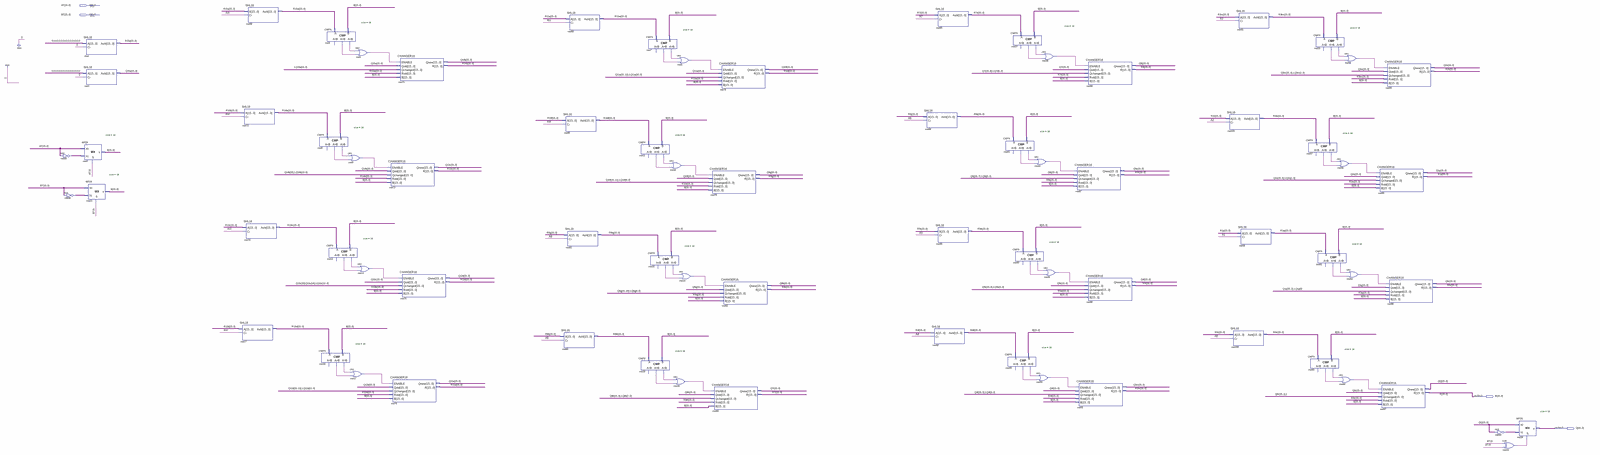
[diagram p0: schematic sheet, whole]
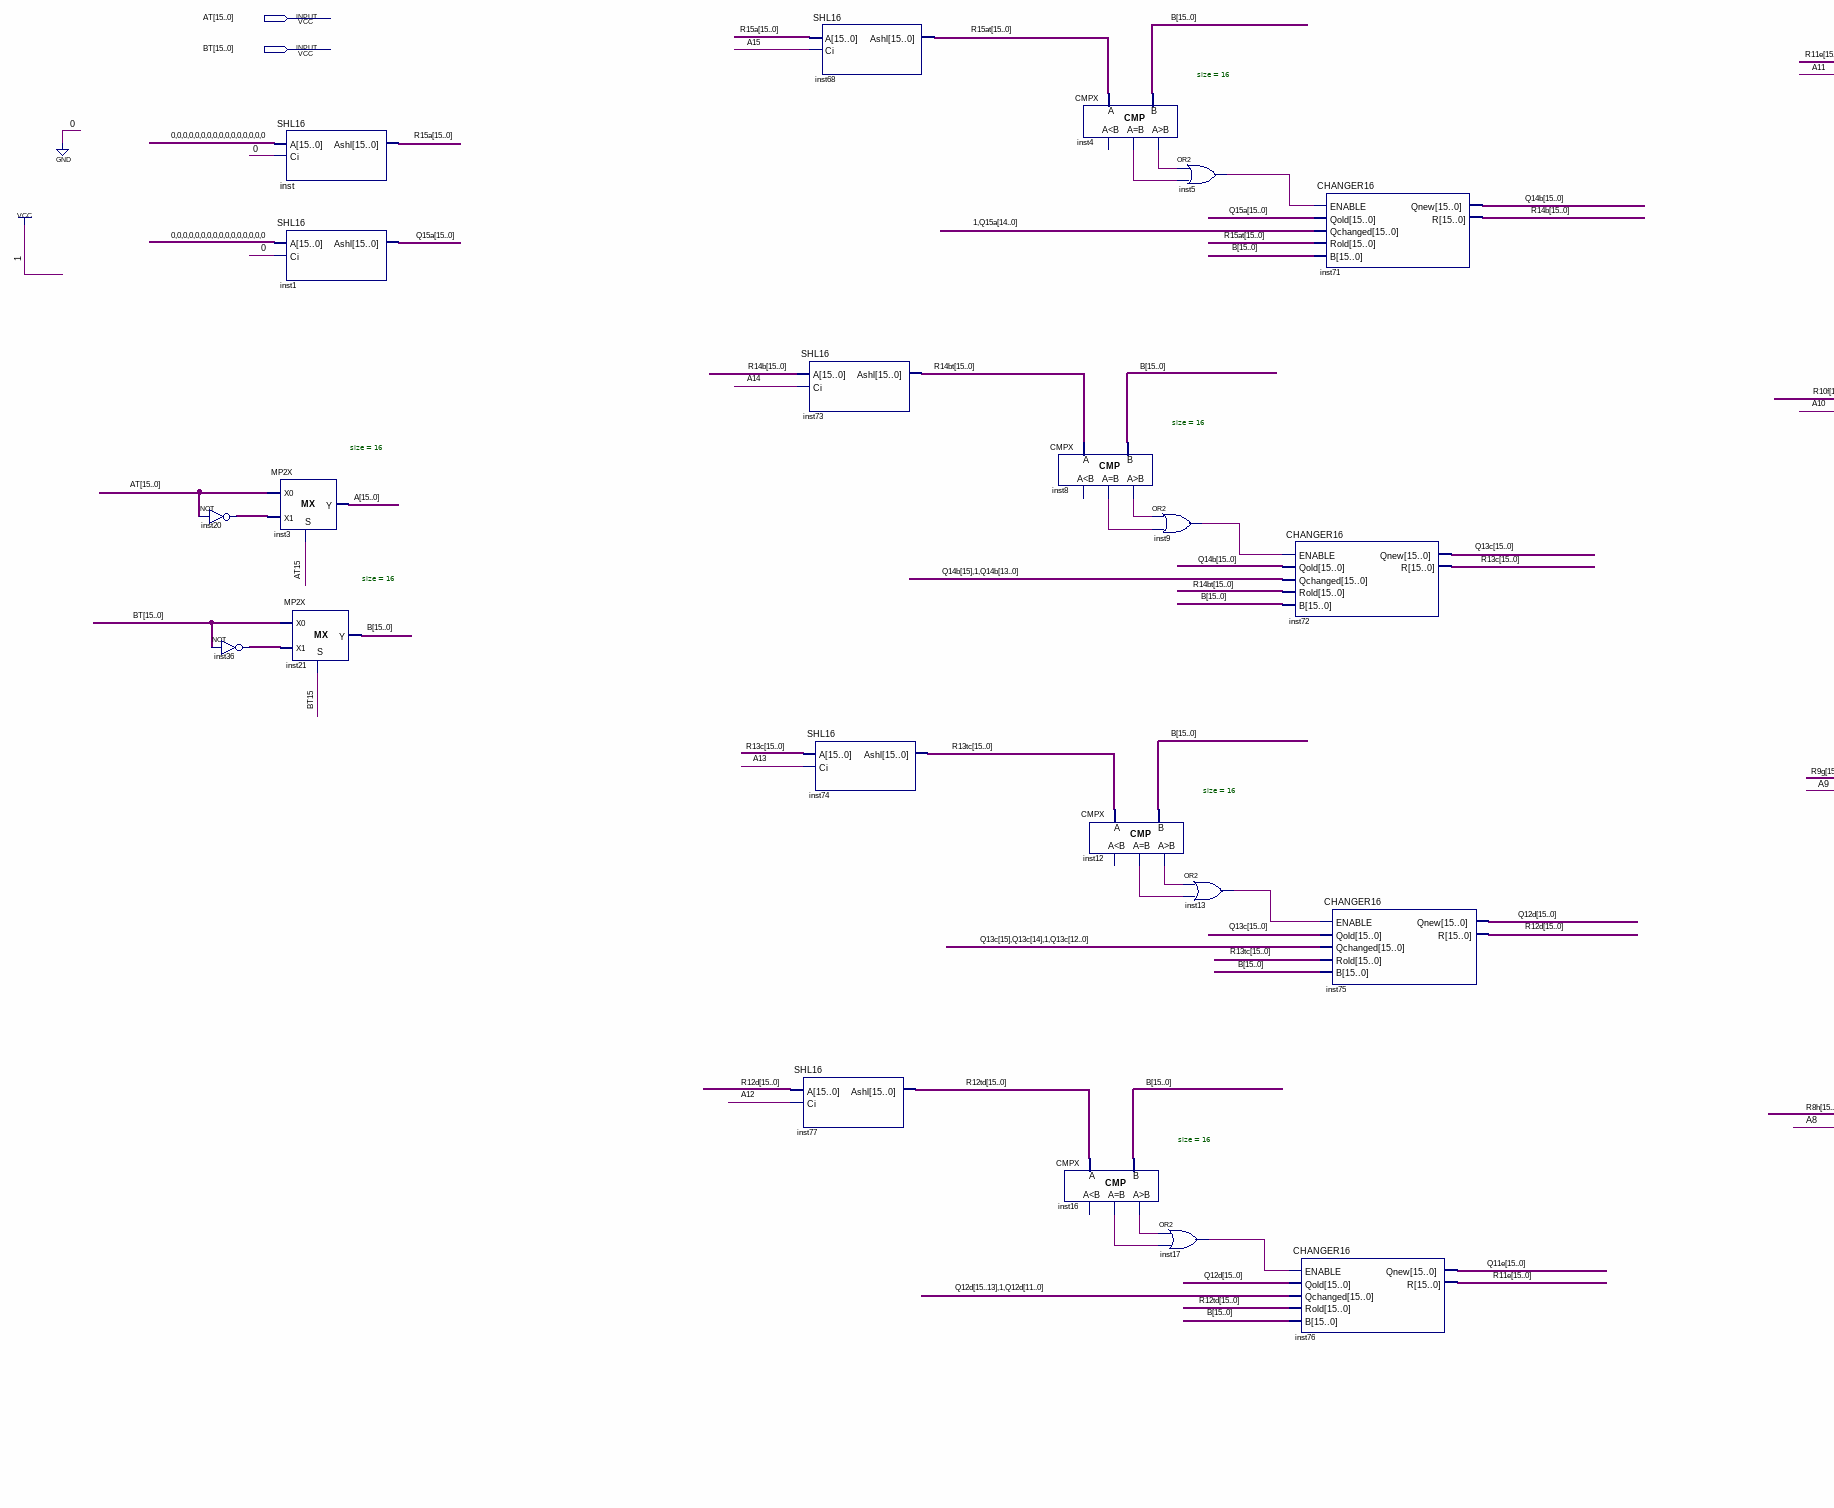
[diagram p1: schematic sheet, left part]
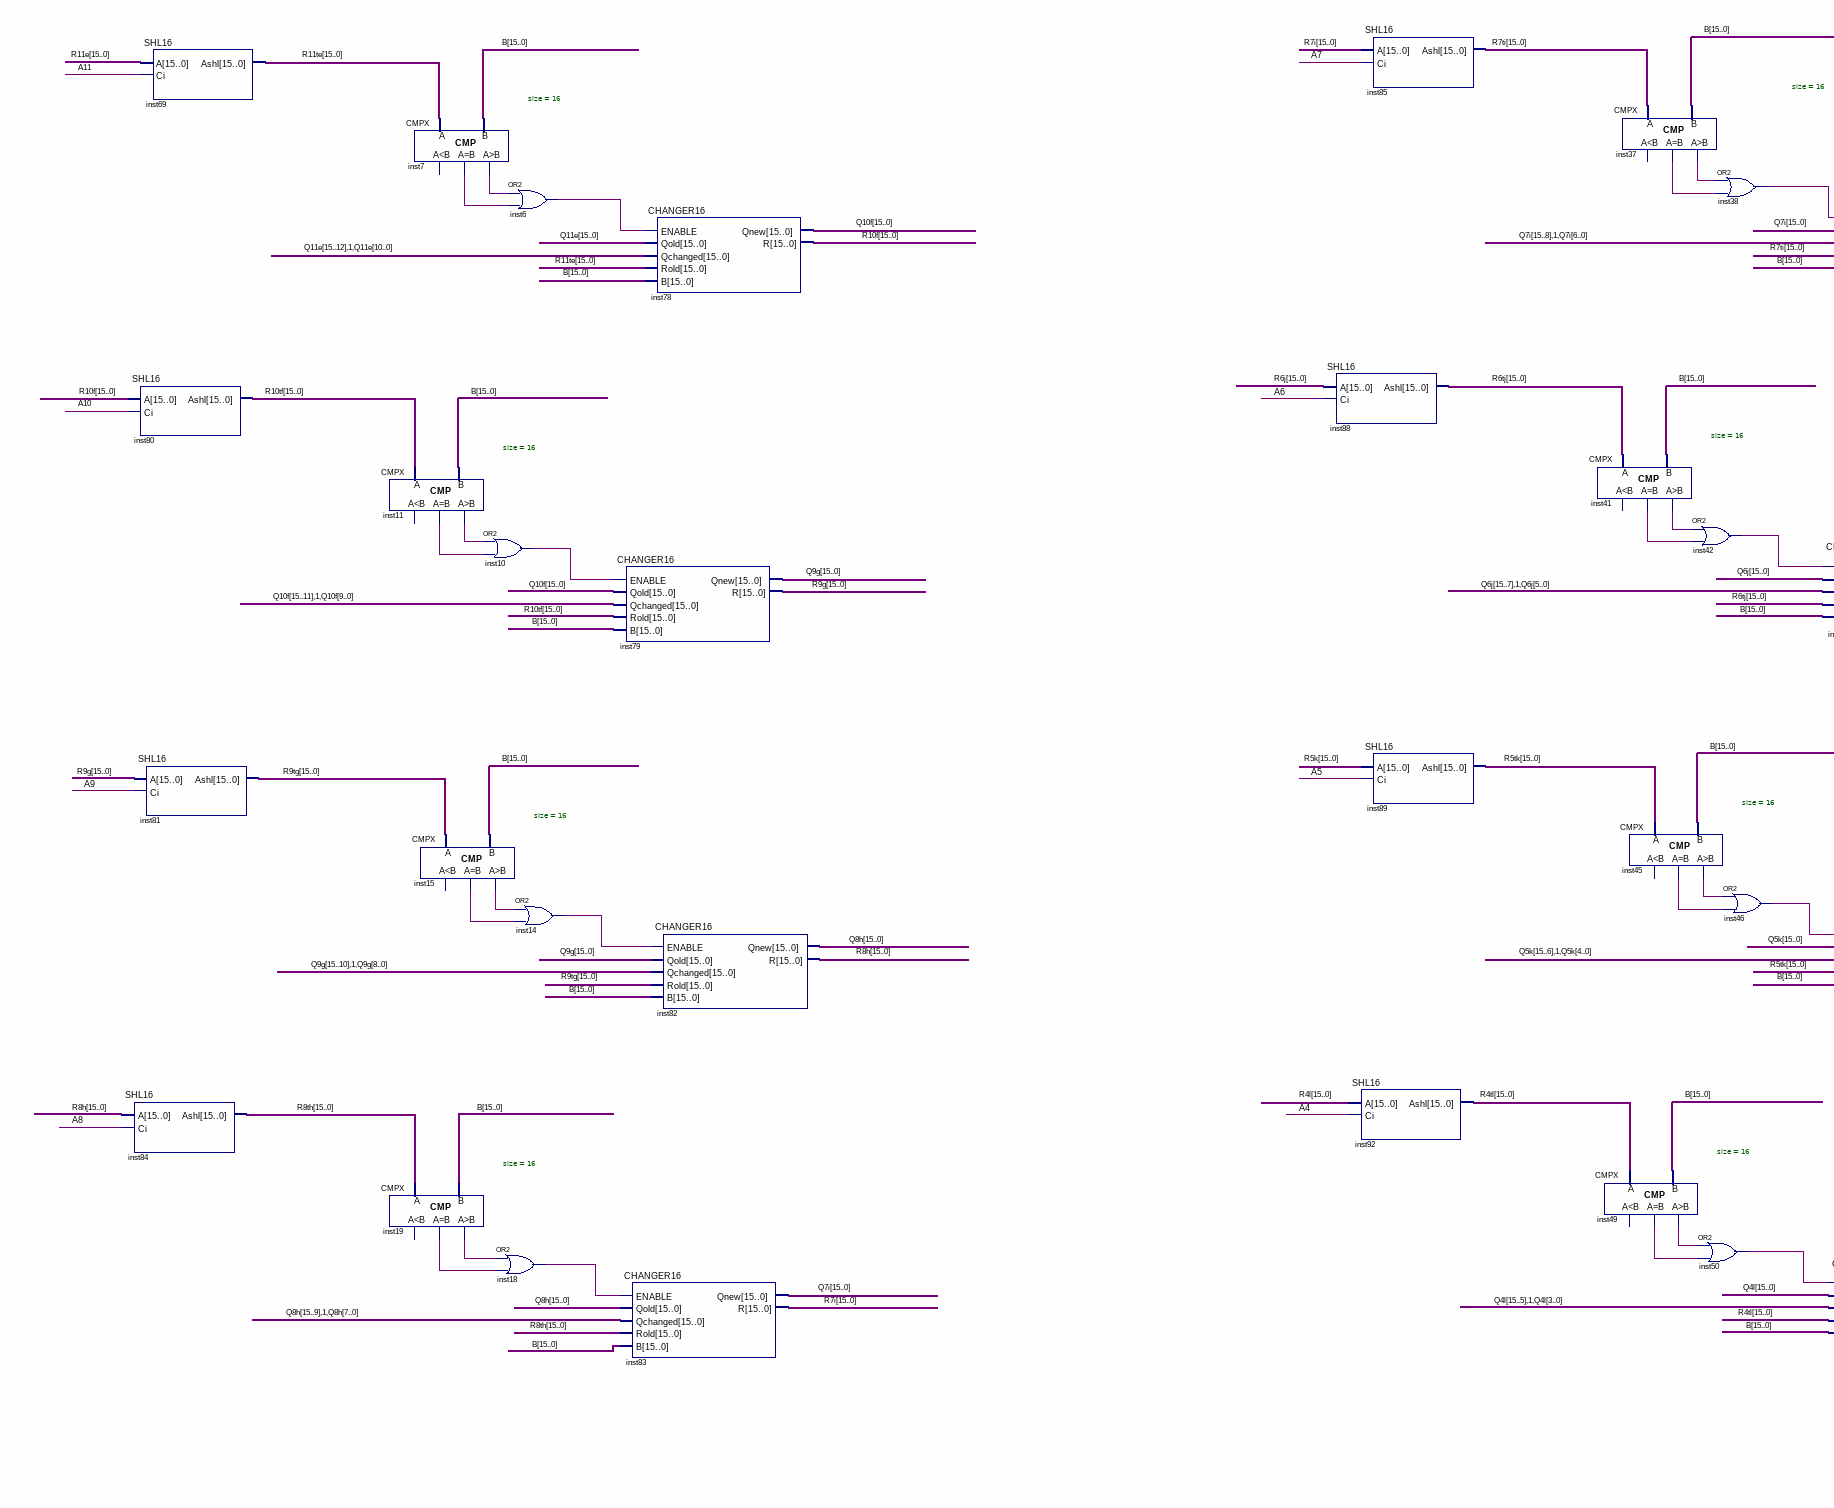
[diagram p2: schematic sheet, centre part]
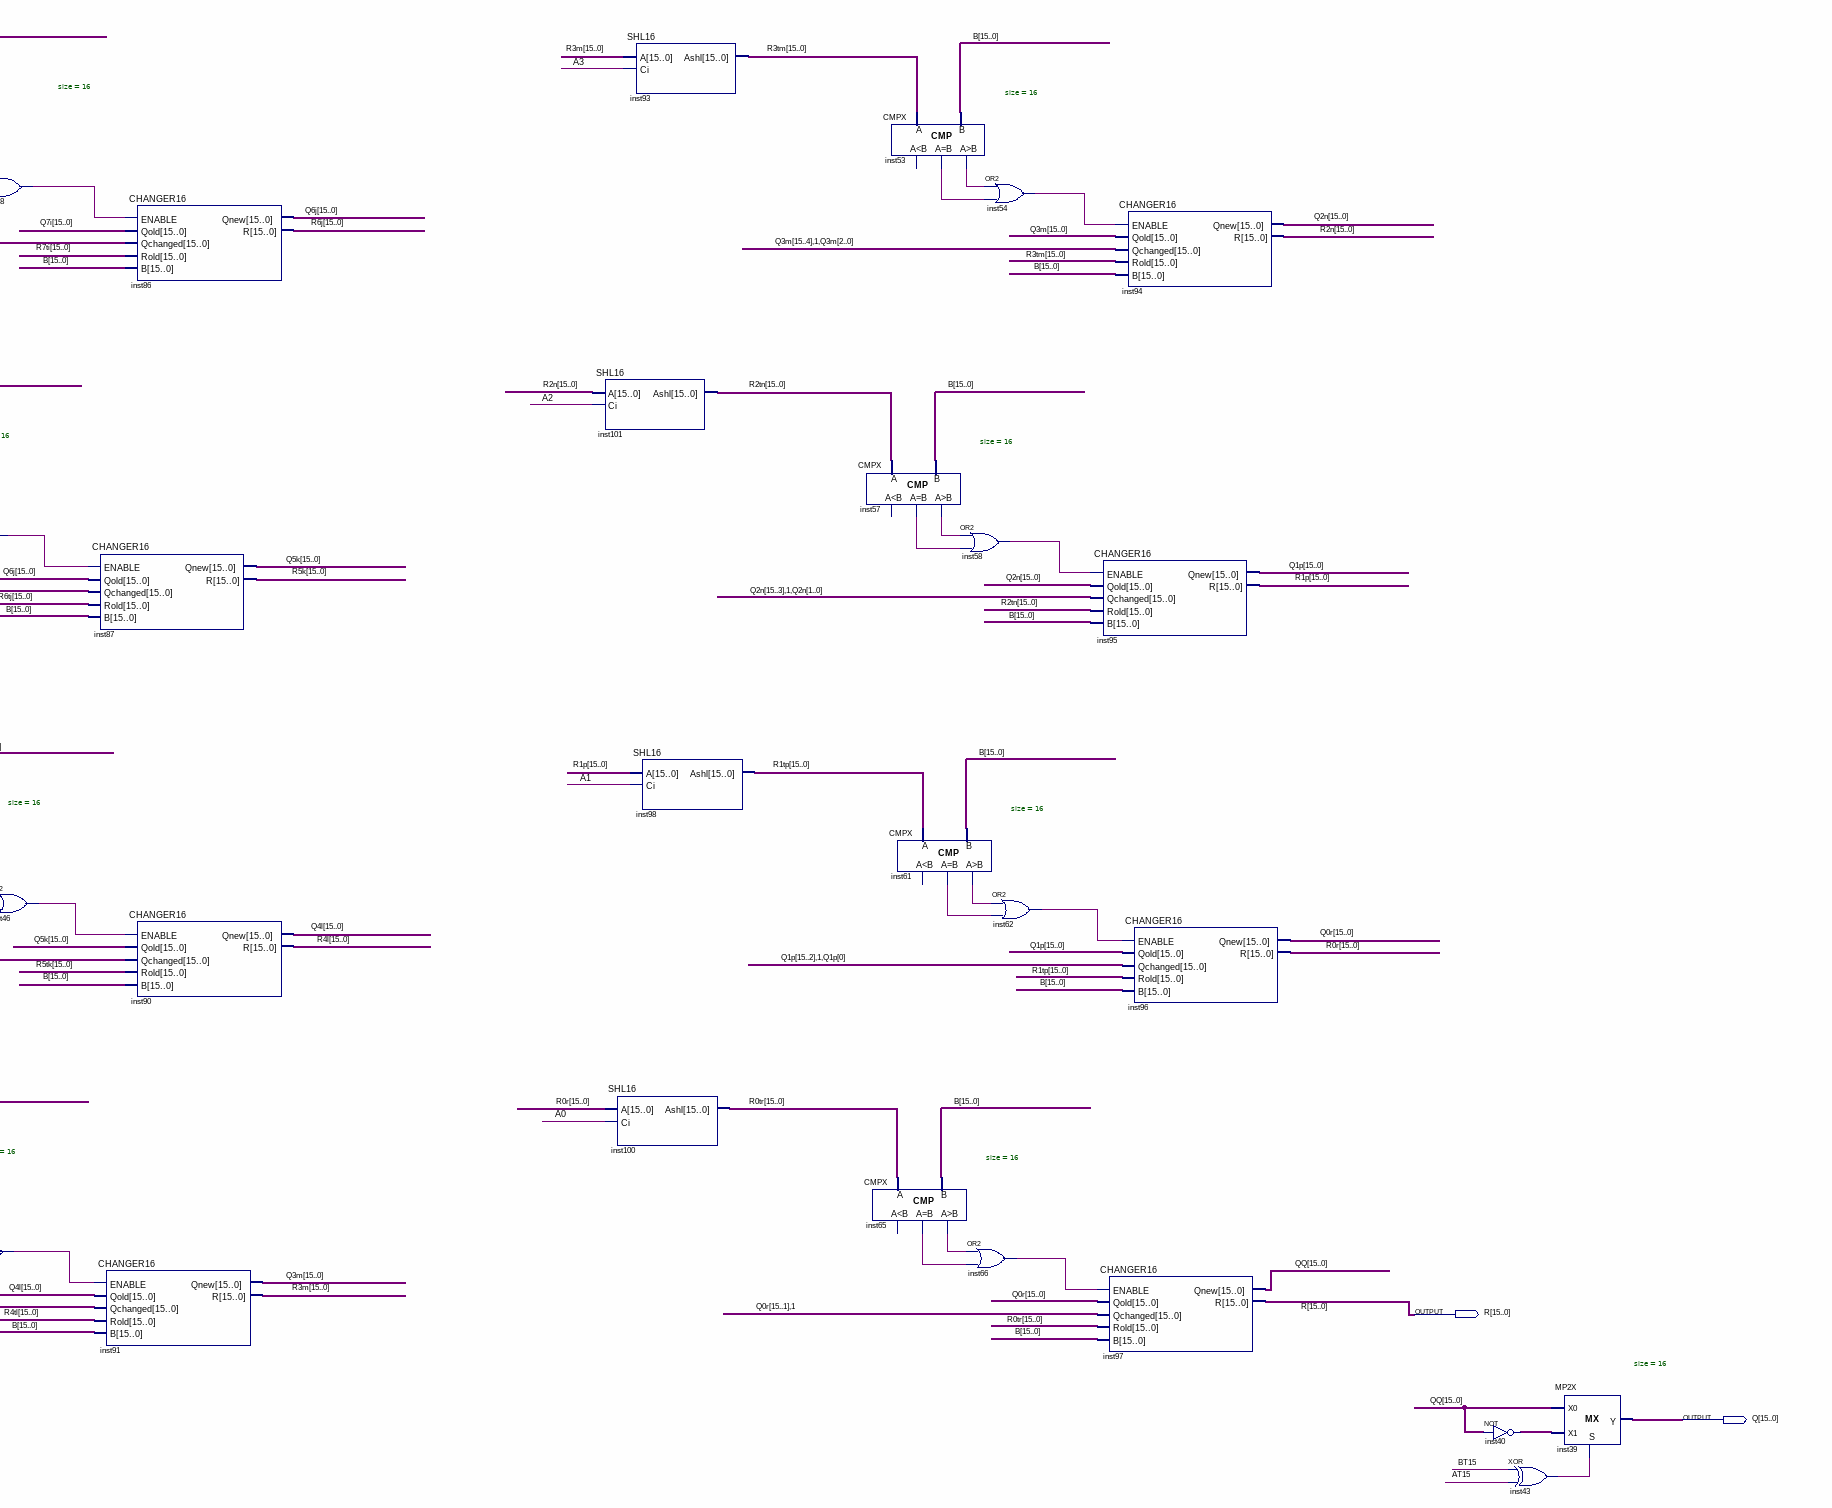
[diagram p3: schematic sheet, right part]
// Quartus schematic DIV16.bdf as structural Verilog: 73 symbols, 4 pins
module DIV16 (
  input  [15:0] AT,
  input  [15:0] BT,
  output [15:0] R,
  output [15:0] Q
);

  wire inst4_eq, inst4_gr, inst5_out, inst6_out, inst7_eq, inst7_gr, inst8_eq, inst8_gr, inst9_out,
       inst10_out, inst11_eq, inst11_gr, inst12_eq, inst12_gr, inst13_out, inst14_out, inst15_eq, inst15_gr,
       inst16_eq, inst16_gr, inst17_out, inst18_out, inst19_eq, inst19_gr, inst37_eq, inst37_gr, inst38_out,
       inst41_eq, inst41_gr, inst42_out, inst43_out, inst45_eq, inst45_gr, inst46_out, inst49_eq, inst49_gr,
       inst50_out, inst53_eq, inst53_gr, inst54_out, inst57_eq, inst57_gr, inst58_out, inst61_eq, inst61_gr,
       inst62_out, inst65_eq, inst65_gr, inst66_out;
  wire [15:0] A, B, inst20_out, inst36_out, inst40_out, Q0r, Q1p, Q2n, Q3m, Q4l, Q5k, Q6j, Q7i, Q8h, Q9g,
       Q10f, Q11e, Q12d, Q13c, Q14b, Q15a, QQ, R0r, R0tr, R1p, R1tp, R2n, R2tn, R3m, R3tm, R4l, R4tl, R5k,
       R5tk, R6j, R6tj, R7i, R7ti, R8h, R8th, R9g, R9tg, R10f, R10tf, R11e, R11te, R12d, R12td, R13c, R13tc,
       R14b, R14bt, R15a, R15at;

  assign inst20_out = ~AT;  // NOT inst20, 16 bits wide
  assign inst36_out = ~BT;  // NOT inst36, 16 bits wide
  SHL16 inst (.A({16{1'b0}}), .Ci(1'b0), .Ashl(R15a));
  SHL16 inst1 (.A({16{1'b0}}), .Ci(1'b0), .Ashl(Q15a));
  MP2X #(.size(16)) inst3 (.S(AT[15]), .X0(AT), .X1(inst20_out), .Y(A));
  MP2X #(.size(16)) inst21 (.S(BT[15]), .X0(BT), .X1(inst36_out), .Y(B));
  SHL16 inst68 (.A(R15a), .Ci(A[15]), .Ashl(R15at));
  SHL16 inst73 (.A(R14b), .Ci(A[14]), .Ashl(R14bt));
  SHL16 inst74 (.A(R13c), .Ci(A[13]), .Ashl(R13tc));
  SHL16 inst77 (.A(R12d), .Ci(A[12]), .Ashl(R12td));
  CMPX #(.size(16)) inst4 (.A(R15at), .B(B), .eq(inst4_eq), .gr(inst4_gr));  // open: ls
  CMPX #(.size(16)) inst8 (.A(R14bt), .B(B), .eq(inst8_eq), .gr(inst8_gr));  // open: ls
  CMPX #(.size(16)) inst12 (.A(R13tc), .B(B), .eq(inst12_eq), .gr(inst12_gr));  // open: ls
  CMPX #(.size(16)) inst16 (.A(R12td), .B(B), .eq(inst16_eq), .gr(inst16_gr));  // open: ls
  or inst5 (inst5_out, inst4_gr, inst4_eq);
  or inst9 (inst9_out, inst8_gr, inst8_eq);
  or inst17 (inst17_out, inst16_gr, inst16_eq);
  or inst13 (inst13_out, inst12_gr, inst12_eq);
  CHANGER16 inst71 (
    .ENABLE(inst5_out), .Qold(Q15a), .Qchanged({1'b1, Q15a[14:0]}), .Rold(R15at), .B(B), .Qnew(Q14b), .R(R14b));
  CHANGER16 inst72 (
    .ENABLE(inst9_out), .Qold(Q14b), .Qchanged({Q14b[15], 1'b1, Q14b[13:0]}), .Rold(R14bt), .B(B),
    .Qnew(Q13c), .R(R13c));
  CHANGER16 inst75 (
    .ENABLE(inst13_out), .Qold(Q13c), .Qchanged({Q13c[15:14], 1'b1, Q13c[12:0]}), .Rold(R13tc), .B(B),
    .Qnew(Q12d), .R(R12d));
  CHANGER16 inst76 (
    .ENABLE(inst17_out), .Qold(Q12d), .Qchanged({Q12d[15:13], 1'b1, Q12d[11:0]}), .Rold(R12td), .B(B),
    .Qnew(Q11e), .R(R11e));
  SHL16 inst69 (.A(R11e), .Ci(A[11]), .Ashl(R11te));
  SHL16 inst80 (.A(R10f), .Ci(A[10]), .Ashl(R10tf));
  SHL16 inst81 (.A(R9g), .Ci(A[9]), .Ashl(R9tg));
  SHL16 inst84 (.A(R8h), .Ci(A[8]), .Ashl(R8th));
  CMPX #(.size(16)) inst11 (.A(R10tf), .B(B), .eq(inst11_eq), .gr(inst11_gr));  // open: ls
  CMPX #(.size(16)) inst19 (.A(R8th), .B(B), .eq(inst19_eq), .gr(inst19_gr));  // open: ls
  CMPX #(.size(16)) inst7 (.A(R11te), .B(B), .eq(inst7_eq), .gr(inst7_gr));  // open: ls
  CMPX #(.size(16)) inst15 (.A(R9tg), .B(B), .eq(inst15_eq), .gr(inst15_gr));  // open: ls
  or inst10 (inst10_out, inst11_gr, inst11_eq);
  or inst6 (inst6_out, inst7_gr, inst7_eq);
  or inst14 (inst14_out, inst15_gr, inst15_eq);
  or inst18 (inst18_out, inst19_gr, inst19_eq);
  CHANGER16 inst79 (
    .ENABLE(inst10_out), .Qold(Q10f), .Qchanged({Q10f[15:11], 1'b1, Q10f[9:0]}), .Rold(R10tf), .B(B),
    .Qnew(Q9g), .R(R9g));
  CHANGER16 inst83 (
    .ENABLE(inst18_out), .Qold(Q8h), .Qchanged({Q8h[15:9], 1'b1, Q8h[7:0]}), .Rold(R8th), .B(B), .Qnew(Q7i),
    .R(R7i));
  CHANGER16 inst78 (
    .ENABLE(inst6_out), .Qold(Q11e), .Qchanged({Q11e[15:12], 1'b1, Q11e[10:0]}), .Rold(R11te), .B(B),
    .Qnew(Q10f), .R(R10f));
  CHANGER16 inst82 (
    .ENABLE(inst14_out), .Qold(Q9g), .Qchanged({Q9g[15:10], 1'b1, Q9g[8:0]}), .Rold(R9tg), .B(B), .Qnew(Q8h),
    .R(R8h));
  SHL16 inst88 (.A(R6j), .Ci(A[6]), .Ashl(R6tj));
  SHL16 inst85 (.A(R7i), .Ci(A[7]), .Ashl(R7ti));
  SHL16 inst89 (.A(R5k), .Ci(A[5]), .Ashl(R5tk));
  SHL16 inst92 (.A(R4l), .Ci(A[4]), .Ashl(R4tl));
  CMPX #(.size(16)) inst41 (.A(R6tj), .B(B), .eq(inst41_eq), .gr(inst41_gr));  // open: ls
  CMPX #(.size(16)) inst37 (.A(R7ti), .B(B), .eq(inst37_eq), .gr(inst37_gr));  // open: ls
  CMPX #(.size(16)) inst45 (.A(R5tk), .B(B), .eq(inst45_eq), .gr(inst45_gr));  // open: ls
  CMPX #(.size(16)) inst49 (.A(R4tl), .B(B), .eq(inst49_eq), .gr(inst49_gr));  // open: ls
  or inst38 (inst38_out, inst37_gr, inst37_eq);
  or inst42 (inst42_out, inst41_gr, inst41_eq);
  or inst46 (inst46_out, inst45_gr, inst45_eq);
  or inst50 (inst50_out, inst49_gr, inst49_eq);
  CHANGER16 inst87 (
    .ENABLE(inst42_out), .Qold(Q6j), .Qchanged({Q6j[15:7], 1'b1, Q6j[5:0]}), .Rold(R6tj), .B(B), .Qnew(Q5k),
    .R(R5k));
  CHANGER16 inst91 (
    .ENABLE(inst50_out), .Qold(Q4l), .Qchanged({Q4l[15:5], 1'b1, Q4l[3:0]}), .Rold(R4tl), .B(B), .Qnew(Q3m),
    .R(R3m));
  CHANGER16 inst86 (
    .ENABLE(inst38_out), .Qold(Q7i), .Qchanged({Q7i[15:8], 1'b1, Q7i[6:0]}), .Rold(R7ti), .B(B), .Qnew(Q6j),
    .R(R6j));
  CHANGER16 inst90 (
    .ENABLE(inst46_out), .Qold(Q5k), .Qchanged({Q5k[15:6], 1'b1, Q5k[4:0]}), .Rold(R5tk), .B(B), .Qnew(Q4l),
    .R(R4l));
  SHL16 inst101 (.A(R2n), .Ci(A[2]), .Ashl(R2tn));
  SHL16 inst93 (.A(R3m), .Ci(A[3]), .Ashl(R3tm));
  SHL16 inst98 (.A(R1p), .Ci(A[1]), .Ashl(R1tp));
  SHL16 inst100 (.A(R0r), .Ci(A[0]), .Ashl(R0tr));
  CMPX #(.size(16)) inst53 (.A(R3tm), .B(B), .eq(inst53_eq), .gr(inst53_gr));  // open: ls
  CMPX #(.size(16)) inst57 (.A(R2tn), .B(B), .eq(inst57_eq), .gr(inst57_gr));  // open: ls
  CMPX #(.size(16)) inst61 (.A(R1tp), .B(B), .eq(inst61_eq), .gr(inst61_gr));  // open: ls
  CMPX #(.size(16)) inst65 (.A(R0tr), .B(B), .eq(inst65_eq), .gr(inst65_gr));  // open: ls
  or inst54 (inst54_out, inst53_gr, inst53_eq);
  or inst58 (inst58_out, inst57_gr, inst57_eq);
  or inst62 (inst62_out, inst61_gr, inst61_eq);
  or inst66 (inst66_out, inst65_gr, inst65_eq);
  CHANGER16 inst95 (
    .ENABLE(inst58_out), .Qold(Q2n), .Qchanged({Q2n[15:3], 1'b1, Q2n[1:0]}), .Rold(R2tn), .B(B), .Qnew(Q1p),
    .R(R1p));
  CHANGER16 inst97 (
    .ENABLE(inst66_out), .Qold(Q0r), .Qchanged({Q0r[15:1], 1'b1}), .Rold(R0tr), .B(B), .Qnew(QQ), .R(R));
  CHANGER16 inst94 (
    .ENABLE(inst54_out), .Qold(Q3m), .Qchanged({Q3m[15:4], 1'b1, Q3m[2:0]}), .Rold(R3tm), .B(B), .Qnew(Q2n),
    .R(R2n));
  CHANGER16 inst96 (
    .ENABLE(inst62_out), .Qold(Q1p), .Qchanged({Q1p[15:2], 1'b1, Q1p[0]}), .Rold(R1tp), .B(B), .Qnew(Q0r),
    .R(R0r));
  assign inst40_out = ~QQ;  // NOT inst40, 16 bits wide
  xor inst43 (inst43_out, BT[15], AT[15]);
  MP2X #(.size(16)) inst39 (.S(inst43_out), .X0(QQ), .X1(inst40_out), .Y(Q));
endmodule
